# EAGLE design ORCA_STLINK_MICRO_DEBUG_8_PIN_UART_BASE (EAGLE 9.7.0)
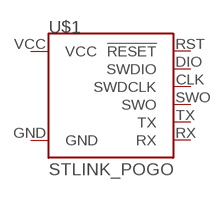
[diagram p0: schematic, sheet 1]

## Parts
U$1  STLINK_POGO  [STLINK_POGO]
Unconnected: U$1.CLK(SWDCLK) U$1.DIO(SWDIO) U$1.RST(!RESET) U$1.RX U$1.SWO U$1.TX

## Power pins joined to a net without a drawn wire
GND: U$1.GND
VCC: U$1.VCC

## Library data of the parts
U$1 = _L_Communication:STLINK_POGO

## Board
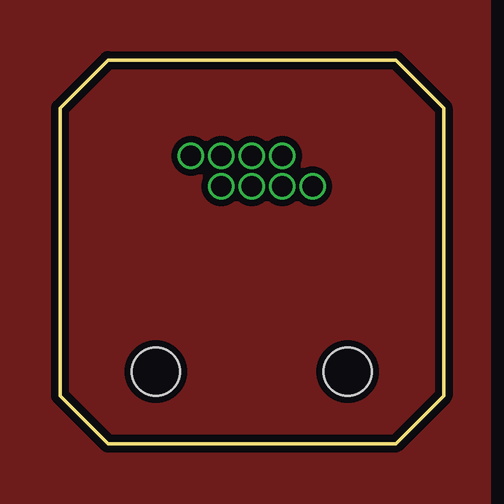
[diagram p1: board, top side]
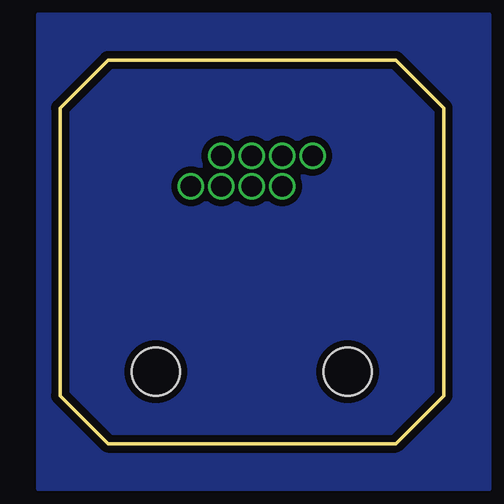
[diagram p2: board, bottom side, seen from below]

Size 16 x 16 mm. Coordinates in mm from the lower left corner, seen from the top.
Outline: 14,0 16,2 16,14 14,16 2,16 0,14 0,2 2,0 14,0
Copper layers (1*16): Top 0.035mm / dielectric 1.5mm / Bottom 0.035mm
Design rules "PCBWay_2L_100um-Track *": minimum track width 0.1mm, minimum drill 0.3mm, track to track 0.1mm, track to pad 0.1mm, pad to pad 0.1mm, via to via 0.1mm, smd to smd 0mil, copper to edge 0.3mm, drill to drill 10mil, minimum pad ring 0.13mm, minimum via ring 0.1mm, stop-mask expansion 2mil, vias tented up to drill 0.45mm, thermal gap 0.2mm
Holes 2 mm at 12,3 4,3

### Footprints (pad centres in the part's own frame; a part is rotated, then mirrored left to right if it is on the bottom)
STLINK_POGO = drill 0.85 pad 1.12 slot 0.85 rotated 90: CLK -1.27,1.27; DIO 0,1.27; GND -1.27,0; RST 0,0; RX 1.27,1.27; SWO 1.27,0; TX 2.54,0; VCC -2.54,1.27

### Placement (x,y rotation side)
U$1  8,10.73 0 top

### Tracks (layer width: path | path; a pad name or v marks a point on that pad's centre or on a via)
N$11
  pour Bottom (isolate 0.254): -1.87,-1.87 16.87,-1.87 16.87,17.87 -1.87,17.87
  pour Top (isolate 0.254): -2.87,-2.87 17.87,-2.87 17.87,18.87 -2.87,18.87